# EAGLE design rgb_dimmer_1 (EAGLE 6.4)
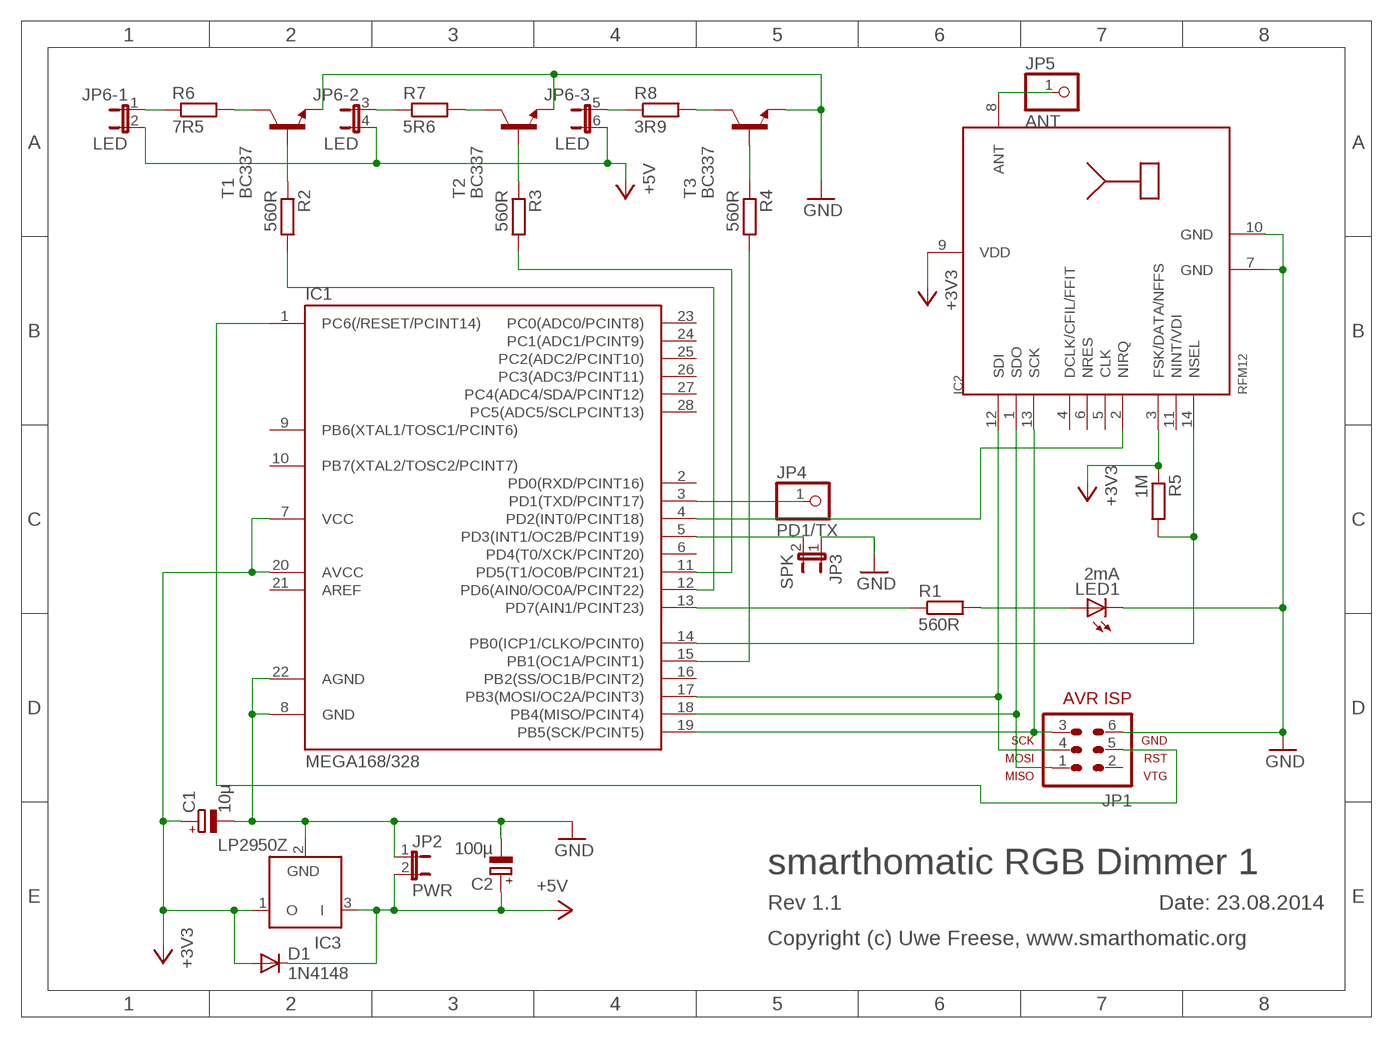
[diagram p0: schematic, sheet 1]

## Parts
C1  10µ  CPOL-EUE1.8-4  [E1,8-4]
C2  100µ  CPOL-EUE2.5-6  [E2,5-6]
D1  1N4148  1N4148DO35-7  [DO35-7]
IC1  MEGA168/328  MEGA48/88/168-PU  [DIL28-3]
IC2  RFM12  [RFM]
IC3  LP2950Z  [TO92]
JP1  AVR-ISP-6  [AVR-ISP-6]
JP2  PWR  JP1E  [JP1]
JP3  SPK  JP1E  [JP1]
JP4  PD1/TX  PINHD-1X1  [1X01]
JP5  ANT  PINHD-1X1  [1X01]
JP6  LED  JP3QE  [JP3Q]
LED1  2mA  LED3MM  [LED3MM]
R1  560R  R-EU_0207/7  [0207/7]
R2  560R  R-EU_0207/7  [0207/7]
R3  560R  R-EU_0207/7  [0207/7]
R4  560R  R-EU_0207/7  [0207/7]
R5  1M  R-EU_0207/7  [0207/7]
R6  7R5  R-EU_0207/7  [0207/7]
R7  5R6  R-EU_0207/7  [0207/7]
R8  3R9  R-EU_0207/7  [0207/7]
T1  BC337  [TO92]
T2  BC337  [TO92]
T3  BC337  [TO92]

## Nets
+3V3: C1.+ D1.A IC1.7(VCC) IC1.20(AVCC) IC2.3(FSK/DATA/NFFS) IC2.9(VDD) IC3.1(O) R5.1
+5V: C2.+ D1.C IC3.3(I) JP2.2 JP6.2 JP6.4 JP6.6
GND: C1.- C2.- IC1.8(GND) IC1.22(AGND) IC2.7(GND) IC2.10(GND) IC3.2(GND) JP1.6 JP2.1 JP3.1 LED1.K(C) T1.1(E) T2.1(E) T3.1(E)
N$1: JP6.1 R6.1
N$3: IC1.17(PB3(MOSI/OC2A/PCINT3)) IC2.12(SDI) JP1.4
N$4: IC1.18(PB4(MISO/PCINT4)) IC2.1(SDO) JP1.1
N$5: IC1.19(PB5(SCK/PCINT5)) IC2.13(SCK) JP1.3
N$6: IC1.13(PD7(AIN1/PCINT23)) R1.1
N$7: R2.1 T1.2(B)
N$8: IC1.1(PC6(/RESET/PCINT14)) JP1.5
N$9: R3.1 T2.2(B)
N$10: R4.1 T3.2(B)
N$11: IC2.8(ANT) JP5.1
N$12: LED1.A R1.2
N$13: IC1.14(PB0(ICP1/CLKO/PCINT0)) IC2.14(NSEL) R5.2
N$14: R6.2 T1.3(C)
N$15: IC1.4(PD2(INT0/PCINT18)) IC2.2(NIRQ)
N$16: JP6.3 R7.1
N$17: R7.2 T2.3(C)
N$18: JP6.5 R8.1
N$19: R8.2 T3.3(C)
N$20: IC1.3(PD1(TXD/PCINT17)) JP4.1
N$21: IC1.12(PD6(AIN0/OC0A/PCINT22)) R2.2
N$22: IC1.11(PD5(T1/OC0B/PCINT21)) R3.2
N$23: IC1.15(PB1(OC1A/PCINT1)) R4.2
N$24: IC1.5(PD3(INT1/OC2B/PCINT19)) JP3.2
Unconnected: IC1.2(PD0(RXD/PCINT16)) IC1.6(PD4(T0/XCK/PCINT20)) IC1.9(PB6(XTAL1/TOSC1/PCINT6)) IC1.10(PB7(XTAL2/TOSC2/PCINT7)) IC1.16(PB2(SS/OC1B/PCINT2)) IC1.21(AREF) IC1.23(PC0(ADC0/PCINT8)) IC1.24(PC1(ADC1/PCINT9)) IC1.25(PC2(ADC2/PCINT10)) IC1.26(PC3(ADC3/PCINT11)) IC1.27(PC4(ADC4/SDA/PCINT12)) IC1.28(PC5(ADC5/SCLPCINT13)) IC2.4(DCLK/CFIL/FFIT) IC2.5(CLK) IC2.6(NRES) IC2.11(NINT/VDI) JP1.2

## Notes on the sheet
- smarthomatic RGB Dimmer 1
- Rev 1.1 | Date: 23.08.2014
- Copyright (c) Uwe Freese, www.smarthomatic.org

## Library data of the parts
C1 C2 = rcl:CPOL-EU: POLARIZED CAPACITOR, European symbol
D1 = diode:1N4148: DIODE high speed (Philips)
IC1 = avr-5-4.16:MEGA48/88/168-PU
IC2 = hopeRF:RFM12
IC3 = linear:LP2950: 100 mA, Low Power Low Dropout Voltage Regulator Source: http://www.onsemi.com/pub/Collateral/LP2950-D.PDF
JP1 = avr-5-4.16:AVR-ISP-6: AVR ISP-6 Serial Programming Header
JP2 JP3 = jumper:JP1E: JUMPER
JP4 JP5 = pinhead:PINHD-1X1: PIN HEADER
JP6 = jumper:JP3QE: JUMPER
LED1 = led:LED: LED OSRAM: - CHIPLED LG R971, LG N971, LY N971, LG Q971, LY Q971, LO R971, LY R971 LH N974, LH R974 LS Q976, LO Q976, LY Q976 LO Q996 - Hyper CHIPLED LW Q18S LB Q993, LB Q99A, LB R99A - SideLED LS A670, LO A670, LY A670, LG A670, LP A670 LB A673, LV A673, LT A673, LW A673 LH A674 LY A675 LS A676, LA A676, LO A676, LY A676, LW A676 LS A679, LY A679, LG A679 - Hyper Micro SIDELED® LS Y876, LA Y876, LO Y876, LY Y876 LT Y87S - SmartLED LW L88C, LW L88S LB L89C, LB L89S, LG L890 LS L89K, LO L89K, LY L89K LS L896, LA L896, LO L896, LY L896 - TOPLED LS T670, LO T670, LY T670, LG T670, LP T670 LSG T670, LSP T670, LSY T670, LOP T670, LYG T670 LG T671, LOG T671, LSG T671 LB T673, LV T673, LT T673, LW T673 LH T674 LS T676, LA T676, LO T676, LY T676, LB T676, LH T676, LSB T676, LW T676 LB T67C, LV T67C, LT T67C, LS T67K, LO T67K, LY T67K, LW E67C LS E67B, LA E67B, LO E67B, LY E67B, LB E67C, LV E67C, LT E67C LW T67C LS T679, LY T679, LG T679 LS T770, LO T770, LY T770, LG T770, LP T770 LB T773, LV T773, LT T773, LW T773 LH T774 LS E675, LA E675, LY E675, LS T675 LS T776, LA T776, LO T776, LY T776, LB T776 LHGB T686 LT T68C, LB T68C - Hyper Mini TOPLED® LB M676 - Mini TOPLED Santana® LG M470 LS M47K, LO M47K, LY M47K Source: http://www.osram.convergy.de LUXEON: - LUMILED® LXK2-PW12-R00, LXK2-PW12-S00, LXK2-PW14-U00, LXK2-PW14-V00 LXK2-PM12-R00, LXK2-PM12-S00, LXK2-PM14-U00 LXK2-PE12-Q00, LXK2-PE12-R00, LXK2-PE12-S00, LXK2-PE14-T00, LXK2-PE14-U00 LXK2-PB12-K00, LXK2-PB12-L00, LXK2-PB12-M00, LXK2-PB14-N00, LXK2-PB14-P00, LXK2-PB14-Q00 LXK2-PR12-L00, LXK2-PR12-M00, LXK2-PR14-Q00, LXK2-PR14-R00 LXK2-PD12-Q00, LXK2-PD12-R00, LXK2-PD12-S00 LXK2-PH12-R00, LXK2-PH12-S00 LXK2-PL12-P00, LXK2-PL12-Q00, LXK2-PL12-R00 Source: www.luxeon.com KINGBRIGHT: KA-3528ASYC Source: www.kingbright.com
R1-R8 = rcl:R-EU_: RESISTOR, European symbol
T1-T3 = transistor:BC337: NPN TRANSISTOR

## Net classes
0 default: clearance 0.305 mm

## Board
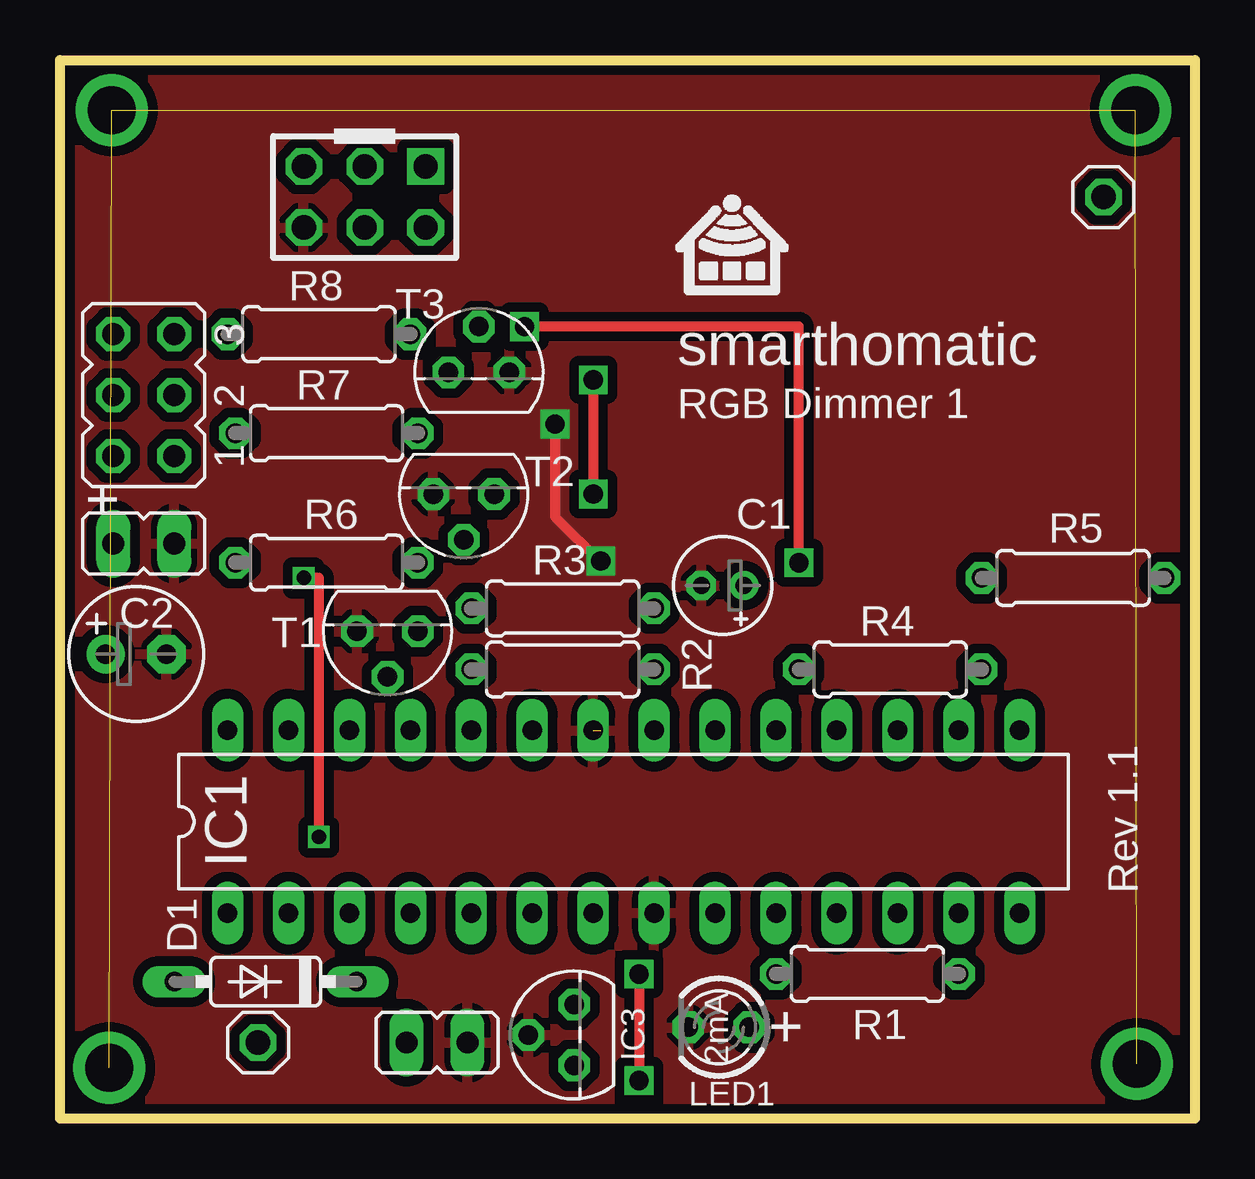
[diagram p1: board, top side]
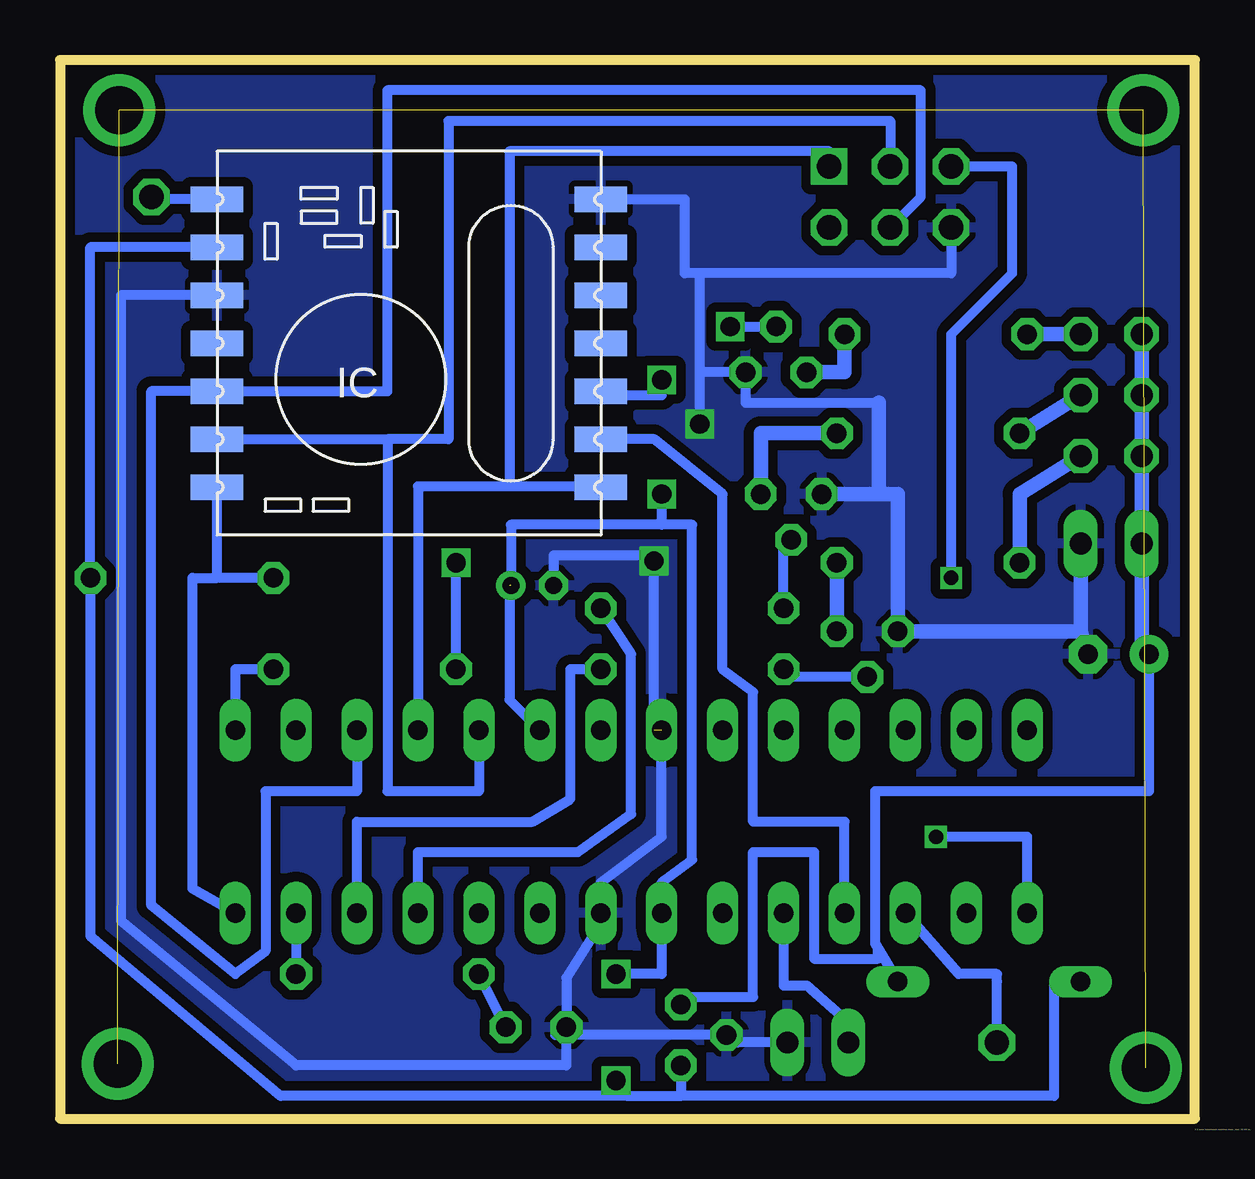
[diagram p2: board, bottom side, seen from below]

Size 47.31 x 44.13 mm. Coordinates in mm from the lower left corner, seen from the top.
Outline: 0,0 0,44.13 47.31,44.13 47.31,0 0,0
Copper layers (1*16): Top 0.035mm / dielectric 1.5mm / Bottom 0.035mm
Design rules "SeeedStudio_2layer_DRU_no_angle_20140221": minimum track width 6mil, minimum drill 12mil, track to track 6mil, track to pad 6mil, pad to pad 6mil, via to via 6mil, smd to smd 0mil, copper to edge 10mil, drill to drill 10mil, minimum pad ring 10mil, minimum via ring 6mil, stop-mask expansion 2mil, vias tented up to drill 100mil, thermal gap 10mil

### Footprints (pad centres in the part's own frame; a part is rotated, then mirrored left to right if it is on the bottom)
E1,8-4 = drill 0.711 pad 1.168: + -0.889,0 | drill 0.711 pad 1.168 octagon: - 0.889,0
E2,5-6 = drill 0.813 pad 1.6: + -1.27,0 | drill 0.813 pad 1.6 octagon: - 1.27,0
DO35-7 = drill 0.813 long: A 3.81,0; C -3.81,0
DIL28-3 = drill 0.813 long: 1 -16.51,-3.81; 2 -13.97,-3.81; 3 -11.43,-3.81; 4 -8.89,-3.81; 5 -6.35,-3.81; 6 -3.81,-3.81; 7 -1.27,-3.81; 8 1.27,-3.81; 9 3.81,-3.81; 10 6.35,-3.81; 11 8.89,-3.81; 12 11.43,-3.81; 13 13.97,-3.81; 14 16.51,-3.81; 15 16.51,3.81; 16 13.97,3.81; 17 11.43,3.81; 18 8.89,3.81; 19 6.35,3.81; 20 3.81,3.81; 21 1.27,3.81; 22 -1.27,3.81; 23 -3.81,3.81; 24 -6.35,3.81; 25 -8.89,3.81; 26 -11.43,3.81; 27 -13.97,3.81; 28 -16.51,3.81
RFM = smd 2.184 x 1.067: 1 0,14; 2 0,12; 3 0,10; 4 0,8; 5 0,6; 6 0,4; 7 0,2; 8 16,2; 9 16,4; 10 16,6; 11 16,8; 12 16,10; 13 16,12; 14 16,14
TO92 = drill 0.813 octagon: 1 -1.27,0; 2 0,1.905; 3 1.27,0
AVR-ISP-6 = drill 1.016 square: 1 -2.54,-1.27 | drill 1.016 octagon: 2 -2.54,1.27; 3 0,-1.27; 4 0,1.27; 5 2.54,-1.27; 6 2.54,1.27
JP1 = drill 0.914 long: 1 0,-1.27; 2 0,1.27
1X01 = drill 1.016 octagon: 1 0,0
JP3Q = drill 0.914 octagon: 1 -2.54,-1.27; 2 -2.54,1.27; 3 0,-1.27; 4 0,1.27; 5 2.54,-1.27; 6 2.54,1.27
LED3MM = drill 0.813 octagon: A -1.27,0; K 1.27,0
0207/7 = drill 0.813 octagon: 1 -3.81,0; 2 3.81,0
TO92' = drill 0.813 octagon: 1 1.27,0; 2 0,1.905; 3 -1.27,0

### Placement (x,y rotation side)
C1  27.62,22.23 180 top
C2  3.17,19.37 0 top
D1  8.57,5.71 180 top
IC1  23.5,12.38 0 top
IC2  24.77,40.32 180 bottom
IC3  21.43,3.49 90 top
JP1  12.7,38.42 180 top
JP2  3.49,23.97 90 top
JP3  15.72,3.18 90 top
JP4  8.26,3.18 0 top
JP5  43.5,38.42 0 top
JP6  3.49,30.16 90 top
LED1  27.46,3.81 180 top
R1  33.66,6.03 180 top
R2  20.95,18.73 0 top
R3  20.95,21.27 0 top
R4  34.61,18.73 0 top
R5  42.23,22.54 180 top
R6  11.11,23.18 0 top
R7  11.11,28.57 0 top
R8  10.79,32.7 0 top
T1  BC337  [TO92']  13.65,20.32 180 top
T2  BC337  [TO92']  16.83,26.04 180 top
T3  BC337  [TO92']  17.46,31.12 0 top

### Tracks (layer width: path | path; a pad name or v marks a point on that pad's centre or on a via)
+3V3  (via drill 0.8)  (1 unrouted)
  Top 0.406: v22.23,30.8 v22.23,26.03 | v24.13,6.03 v24.13,1.59
  Bottom 0.406: IC2.3 24.77,30.16 22.23,30.16 v22.23,30.8 | 22.23,24.76 20.95,24.76 20.95,10.8 22.23,9.84 IC1.7 22.23,6.03 v24.13,6.03 | 22.23,24.76 28.51,24.76 C1.+ | v22.23,26.03 22.23,24.76 | IC3.1 21.43,0.95 | D1.A 5.87,5.71 5.87,0.95 21.43,0.95 | IC2.9 46.04,36.32 R5.1 46.04,7.62 38.1,0.95 23.65,0.95 | v24.13,1.59 23.65,0.95 | 23.65,0.95 21.43,0.95 | IC1.20 28.57,17.46 28.57,22.23
+5V
  Bottom 0.406: 13.21,7.09 13.34,7.3 13.34,13.65 1.91,13.65 C2.+ | 13.21,7.09 D1.C | IC3.3 21.43,5.08 18.41,5.08 18.41,11.11 15.88,11.11 15.88,6.67 13.21,6.67 13.21,7.09
  Bottom 0.61: JP6.6 JP6.4 JP6.2 JP2.2 2.22,19.43 C2.+
GND  (via drill 0.8)  (1 unrouted)
  Top 0.406: v20.64,28.96 20.64,25.08 22.54,23.18 v22.54,23.24
  Bottom 0.406: IC2.10 44.77,34.32 44.77,8.25 37.47,2.22 26.19,2.22 LED1.K | JP1.6 10.16,35.24 20.64,35.24 | 20.64,35.24 21.27,35.24 21.27,38.32 IC2.7 | 22.54,16.19 v22.54,23.24 22.54,23.49 26.73,23.49 C1.- | LED1.K 26.19,5.87 25.08,7.62 24.77,7.62 IC1.8 24.77,9.84 22.23,11.75 IC1.22 | v20.64,28.96 20.64,31.12 | 20.64,31.12 20.64,35.24 | 20.64,31.12 T3.1 18.73,29.85 13.18,29.85 | JP3.1 19.05,3.18 IC3.2 26.67,3.49 LED1.K
  Bottom 0.61: T2.1 13.18,26.03 | 13.18,29.85 13.18,26.03 | 13.18,26.03 12.38,26.03 T1.1 4.76,20.32 | JP2.1 4.76,20.32 | C2.- 4.76,20.32
  pour Bottom (isolate 0.406): -1.27,45.4 48.26,45.4 48.26,-0.32 -1.27,-0.32
  pour Top (isolate 0.406): -0.32,44.77 47.94,44.77 47.94,-0.95 -0.32,-0.95
N$1
  Bottom 0.61: JP6.1 7.3,26.03 R6.1
N$2  (via drill 2)  (3 unrouted)
  other vias: 2.16,42.04 44.83,42.04 44.89,2.29 2.05,2.12
N$3
  Bottom 0.406: IC1.17 34.92,13.65 38.73,13.65 38.73,6.99 40.01,6.03 43.5,8.89 43.5,30.32 IC2.12 33.66,30.32 33.66,42.86 11.43,42.86 11.43,38.42 JP1.4
N$4
  Bottom 0.406: JP1.1 15.24,40.32 28.57,40.32 28.57,26.35 | 28.57,26.35 32.38,26.35 IC1.18 | IC2.1 24.77,26.35 28.57,26.35
N$5
  Bottom 0.406: IC1.19 29.84,13.65 33.66,13.65 33.66,28.32 | JP1.3 12.7,41.59 31.11,41.59 31.11,28.32 33.66,28.32 | IC2.13 33.66,28.32
N$6
  Bottom 0.406: IC1.13 R1.1
N$7
  Bottom 0.406: T1.2 17.14,18.42 R2.1
N$8  (via drill 0.6)
  Top 0.406: v10.79,11.75 10.79,22.54 v10.16,22.54
  Bottom 0.406: IC1.1 6.99,11.75 v10.79,11.75 | v10.16,22.54 10.16,32.7 7.62,35.24 7.62,39.69 JP1.5
N$9
  Bottom 0.406: R3.1 17.14,24.13 T2.2
N$10  (via drill 0.8)
  Top 0.406: v30.8,23.18 30.8,33.02 v19.37,33.02
  Bottom 0.406: R4.1 v30.8,23.18 | v19.37,33.02 T3.2
N$11
  Bottom 0.406: IC2.8 43.5,38.32 JP5.1
N$12
  Bottom 0.406: LED1.A R1.2
N$13
  Bottom 0.406: IC1.14 41.78,9.59 41.78,18.73 41.78,22.54 40.77,22.54 | R5.2 40.77,22.54 | 40.77,22.54 IC2.14
N$14
  Bottom 0.61: T1.3 R6.2
N$15
  Bottom 0.406: IC1.4 14.61,12.38 18.41,12.38 18.41,17.78 19.68,18.73 19.68,26.03 22.54,28.32 IC2.2
N$16
  Bottom 0.61: JP6.3 R7.1
N$17
  Bottom 0.61: T2.3 18.1,28.57 R7.2
N$18
  Bottom 0.61: JP6.5 R8.1
N$19
  Bottom 0.61: R8.2 14.61,31.12 T3.3
N$20
  Bottom 0.406: JP4.1 8.26,5.71 8.26,6.03 9.84,6.03 IC1.3
N$21
  Bottom 0.406: IC1.12 34.92,12.38 27.62,12.38 26.04,13.33 26.04,18.73 R2.2
N$22
  Bottom 0.406: IC1.11 32.38,11.11 25.72,11.11 23.5,12.7 23.5,19.37 R3.2
N$23
  Bottom 0.406: R4.2 40.01,18.73 IC1.15
N$24
  Bottom 0.406: IC1.5 17.14,7.94 17.14,5.56 16.19,5.56 14.76,4.29 14.45,3.97 JP3.2

### Text on the board
tNames: smarthomatic | RGB Dimmer 1 | + | Rev 1.1 | + | 2mA
bNames: D:/Eigene Dateien/smarthomatic/logo/logo_black 150x133.bmp
tValues: B | G | R